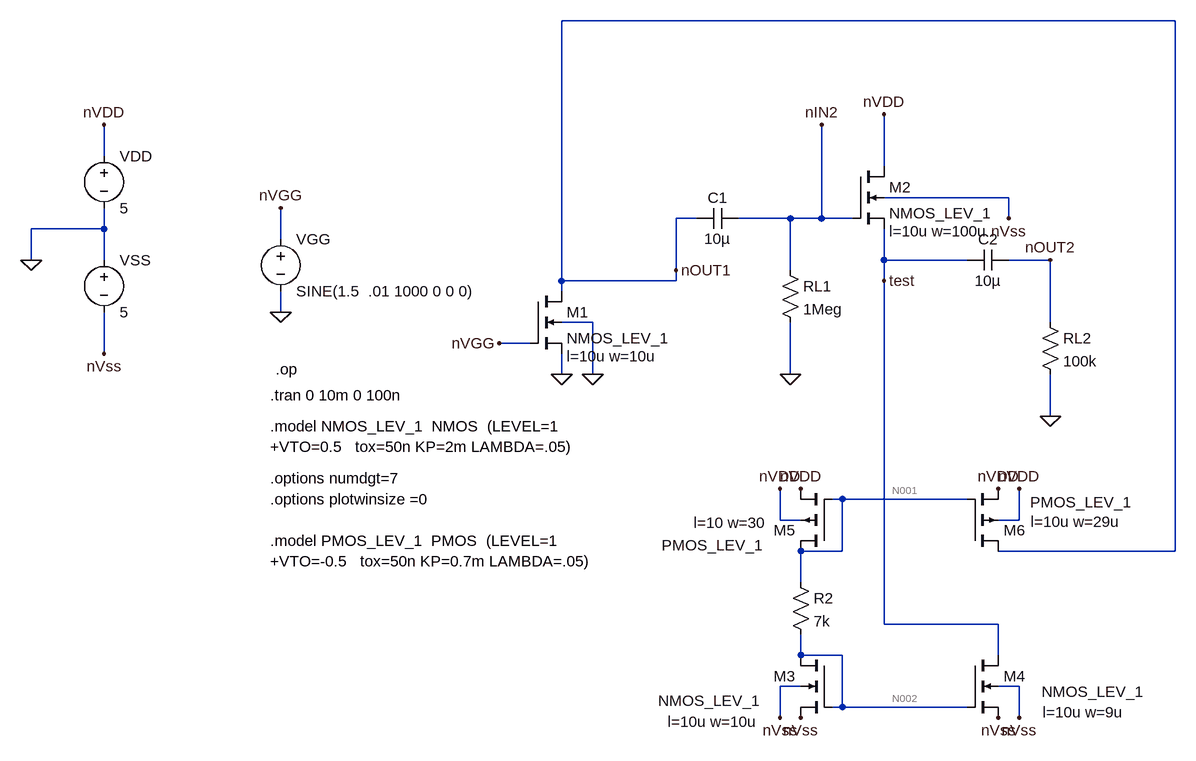
[diagram p0: schematic hw5.asc]
hw5.asc, the LTspice schematic file:
Version 4
SHEET 1 1044 916
WIRE 1040 -256 96 -256
WIRE -608 -48 -608 -96
WIRE 592 -32 592 -112
WIRE 784 16 592 16
WIRE 304 48 272 48
WIRE 448 48 368 48
WIRE 496 48 496 -96
WIRE 496 48 448 48
WIRE 544 48 496 48
WIRE 784 48 784 16
WIRE -608 64 -608 32
WIRE -608 64 -720 64
WIRE -336 80 -336 32
WIRE -720 112 -720 64
WIRE -608 112 -608 64
WIRE 592 112 592 64
WIRE 720 112 592 112
WIRE 848 112 784 112
WIRE 272 128 272 48
WIRE 448 128 448 48
WIRE 96 144 96 -256
WIRE 272 144 272 128
WIRE 272 144 96 144
WIRE 592 144 592 112
WIRE 96 160 96 144
WIRE -336 192 -336 160
WIRE 144 208 96 208
WIRE 848 208 848 112
WIRE 48 240 0 240
WIRE -608 256 -608 192
WIRE 96 288 96 256
WIRE 144 288 144 208
WIRE 448 288 448 208
WIRE 848 352 848 288
WIRE 528 480 512 480
WIRE 720 480 528 480
WIRE 432 512 432 464
WIRE 464 512 432 512
WIRE 800 512 800 464
WIRE 800 512 768 512
WIRE 528 560 528 480
WIRE 528 560 464 560
WIRE 1040 560 1040 -256
WIRE 1040 560 768 560
WIRE 464 608 464 560
WIRE 592 672 592 144
WIRE 768 672 592 672
WIRE 464 720 464 688
WIRE 528 720 464 720
WIRE 768 720 768 672
WIRE 464 768 432 768
WIRE 800 768 768 768
WIRE 528 800 528 720
WIRE 528 800 512 800
WIRE 720 800 528 800
WIRE 432 816 432 768
WIRE 800 816 800 768
FLAG -336 192 0
FLAG -608 -96 nVDD
FLAG -336 32 nVGG
FLAG 0 240 nVGG
FLAG 272 128 nOUT1
FLAG 592 -112 nVDD
FLAG -608 256 nVss
FLAG -720 112 0
FLAG 96 288 0
FLAG 144 288 0
FLAG 848 112 nOUT2
FLAG 848 352 0
FLAG 448 288 0
FLAG 496 -96 nIN2
FLAG 784 48 nVss
FLAG 464 464 nVDD
FLAG 768 464 nVDD
FLAG 464 816 nVss
FLAG 768 816 nVss
FLAG 432 464 nVDD
FLAG 800 464 nVDD
FLAG 432 816 nVss
FLAG 800 816 nVss
FLAG 592 144 test
DATAFLAG 160 144 ""
DATAFLAG 496 -48 ""
DATAFLAG 672 112 "$"
DATAFLAG 16 240 ""
SYMBOL voltage -336 64 R0
WINDOW 123 0 0 Left 0
WINDOW 39 0 0 Left 0
SYMATTR InstName VGG
SYMATTR Value SINE(1.5  .01 1000 0 0 0)
SYMBOL voltage -608 -64 R0
WINDOW 123 0 0 Left 0
WINDOW 39 0 0 Left 0
SYMATTR InstName VDD
SYMATTR Value 5
SYMBOL nmos4 48 160 R0
WINDOW 123 56 100 Left 2
SYMATTR Value2 l=10u w=10u
SYMATTR InstName M1
SYMATTR Value NMOS_LEV_1
SYMBOL nmos4 544 -32 R0
WINDOW 123 56 100 Left 2
SYMATTR Value2 l=10u w=100u
SYMATTR InstName M2
SYMATTR Value NMOS_LEV_1
SYMBOL voltage -608 96 R0
SYMATTR InstName VSS
SYMATTR Value 5
SYMBOL res 832 192 R0
SYMATTR InstName RL2
SYMATTR Value 100k
SYMBOL cap 784 96 R90
WINDOW 0 0 32 VBottom 2
WINDOW 3 32 32 VTop 2
SYMATTR InstName C2
SYMATTR Value 10µ
SYMBOL res 432 112 R0
SYMATTR InstName RL1
SYMATTR Value 1Meg
SYMBOL cap 368 32 R90
WINDOW 0 0 32 VBottom 2
WINDOW 3 32 32 VTop 2
SYMATTR InstName C1
SYMATTR Value 10µ
SYMBOL nmos4 512 720 M0
WINDOW 123 114 102 Left 2
WINDOW 3 110 70 Left 2
SYMATTR Value2 l=10u w=10u
SYMATTR InstName M3
SYMATTR Value NMOS_LEV_1
SYMBOL nmos4 720 720 R0
WINDOW 123 116 88 Left 2
WINDOW 3 115 56 Left 2
SYMATTR Value2 l=10u w=9u
SYMATTR InstName M4
SYMATTR Value NMOS_LEV_1
SYMBOL pmos4 512 560 R180
WINDOW 3 106 9 Left 2
WINDOW 123 101 44 Left 2
SYMATTR InstName M5
SYMATTR Value PMOS_LEV_1
SYMATTR Value2 l=10 w=30
SYMBOL pmos4 720 560 M180
WINDOW 3 97 75 Left 2
WINDOW 123 98 45 Left 2
SYMATTR InstName M6
SYMATTR Value PMOS_LEV_1
SYMATTR Value2 l=10u w=29u
SYMBOL res 448 592 R0
SYMATTR InstName R2
SYMATTR Value 7k
TEXT -352 368 Left 2 !.model NMOS_LEV_1  NMOS  (LEVEL=1\n+VTO=0.5   tox=50n KP=2m LAMBDA=.05)
TEXT -352 448 Left 2 !.options numdgt=7
TEXT -352 480 Left 2 !.options plotwinsize =0
TEXT -344 280 Left 2 !.op
TEXT -352 320 Left 2 !.tran 0 10m 0 100n
TEXT -352 544 Left 2 !.model PMOS_LEV_1  PMOS  (LEVEL=1\n+VTO=-0.5   tox=50n KP=0.7m LAMBDA=.05)

The netlist it stands for:
* hw5.asc
VGG nVGG 0 SINE(1.5  .01 1000 0 0 0)
VDD nVDD 0 5
M1 nOUT1 nVGG 0 0 NMOS_LEV_1 l=10u w=10u
M2 nVDD nIN2 test nVss NMOS_LEV_1 l=10u w=100u
VSS 0 nVss 5
RL2 nOUT2 0 100k
C2 nOUT2 test 10µ
RL1 nIN2 0 1Meg
C1 nIN2 nOUT1 10µ
M3 N002 N002 nVss nVss NMOS_LEV_1 l=10u w=10u
M4 test N002 nVss nVss NMOS_LEV_1 l=10u w=9u
M5 N001 N001 nVDD nVDD PMOS_LEV_1 l=10 w=30
M6 nOUT1 N001 nVDD nVDD PMOS_LEV_1 l=10u w=29u
R2 N001 N002 7k
.model NMOS NMOS
.model PMOS PMOS
.lib standard.mos
.model NMOS_LEV_1  NMOS  (LEVEL=1
+VTO=0.5   tox=50n KP=2m LAMBDA=.05)
.options numdgt=7
.options plotwinsize =0
.op
.tran 0 10m 0 100n
.model PMOS_LEV_1  PMOS  (LEVEL=1
+VTO=-0.5   tox=50n KP=0.7m LAMBDA=.05)
.backanno
.end

* Results of the author's LTspice run, read from the files saved beside the schematic
* Operating Point, zero values left out:
*   V(nvgg) = 1.5 V
*   V(nvdd) = 5 V
*   V(nout1) = 1.463 V
*   V(test) = -782.2 mV
*   V(nvss) = -5 V
*   V(n002) = -3.529 V
*   V(n001) = 3.552 V
*   Id(M6) = -1.073 mA
*   Ib(M6) = 3.547 pA
*   Is(M6) = 1.073 mA
*   Id(M5) = -1.012 mA
*   Ib(M5) = 1.458 pA
*   Is(M5) = 1.012 mA
*   Id(M4) = 1.027 mA
*   Ib(M4) = -4.228 pA
*   Is(M4) = -1.027 mA
*   Id(M3) = 1.012 mA
*   Ib(M3) = -1.481 pA
*   Is(M3) = -1.012 mA
*   Id(M2) = 1.027 mA
*   Ib(M2) = -14.24 pA
*   Is(M2) = -1.027 mA
*   Id(M1) = 1.073 mA
*   Ib(M1) = -1.473 pA
*   Is(M1) = -1.073 mA
*   I(R2) = 1.012 mA
*   I(Vss) = -2.039 mA
*   I(Vdd) = -3.112 mA